# EasyEDA Pro project ProPrj_ESP32SoundBoard_2026-02-01.epro, schematic Development Board Pinouts

## Sheets
1 Development Board Pinouts: Create Date: 2026-01-09; Page Name: Development Board Pinouts; Project Name: ESP32SoundBoard; Schematic Name: Development Board Pinouts; Update Date: 2026-01-09; Company: EasyEDA.com; Page Size: A4; Version: V1.0
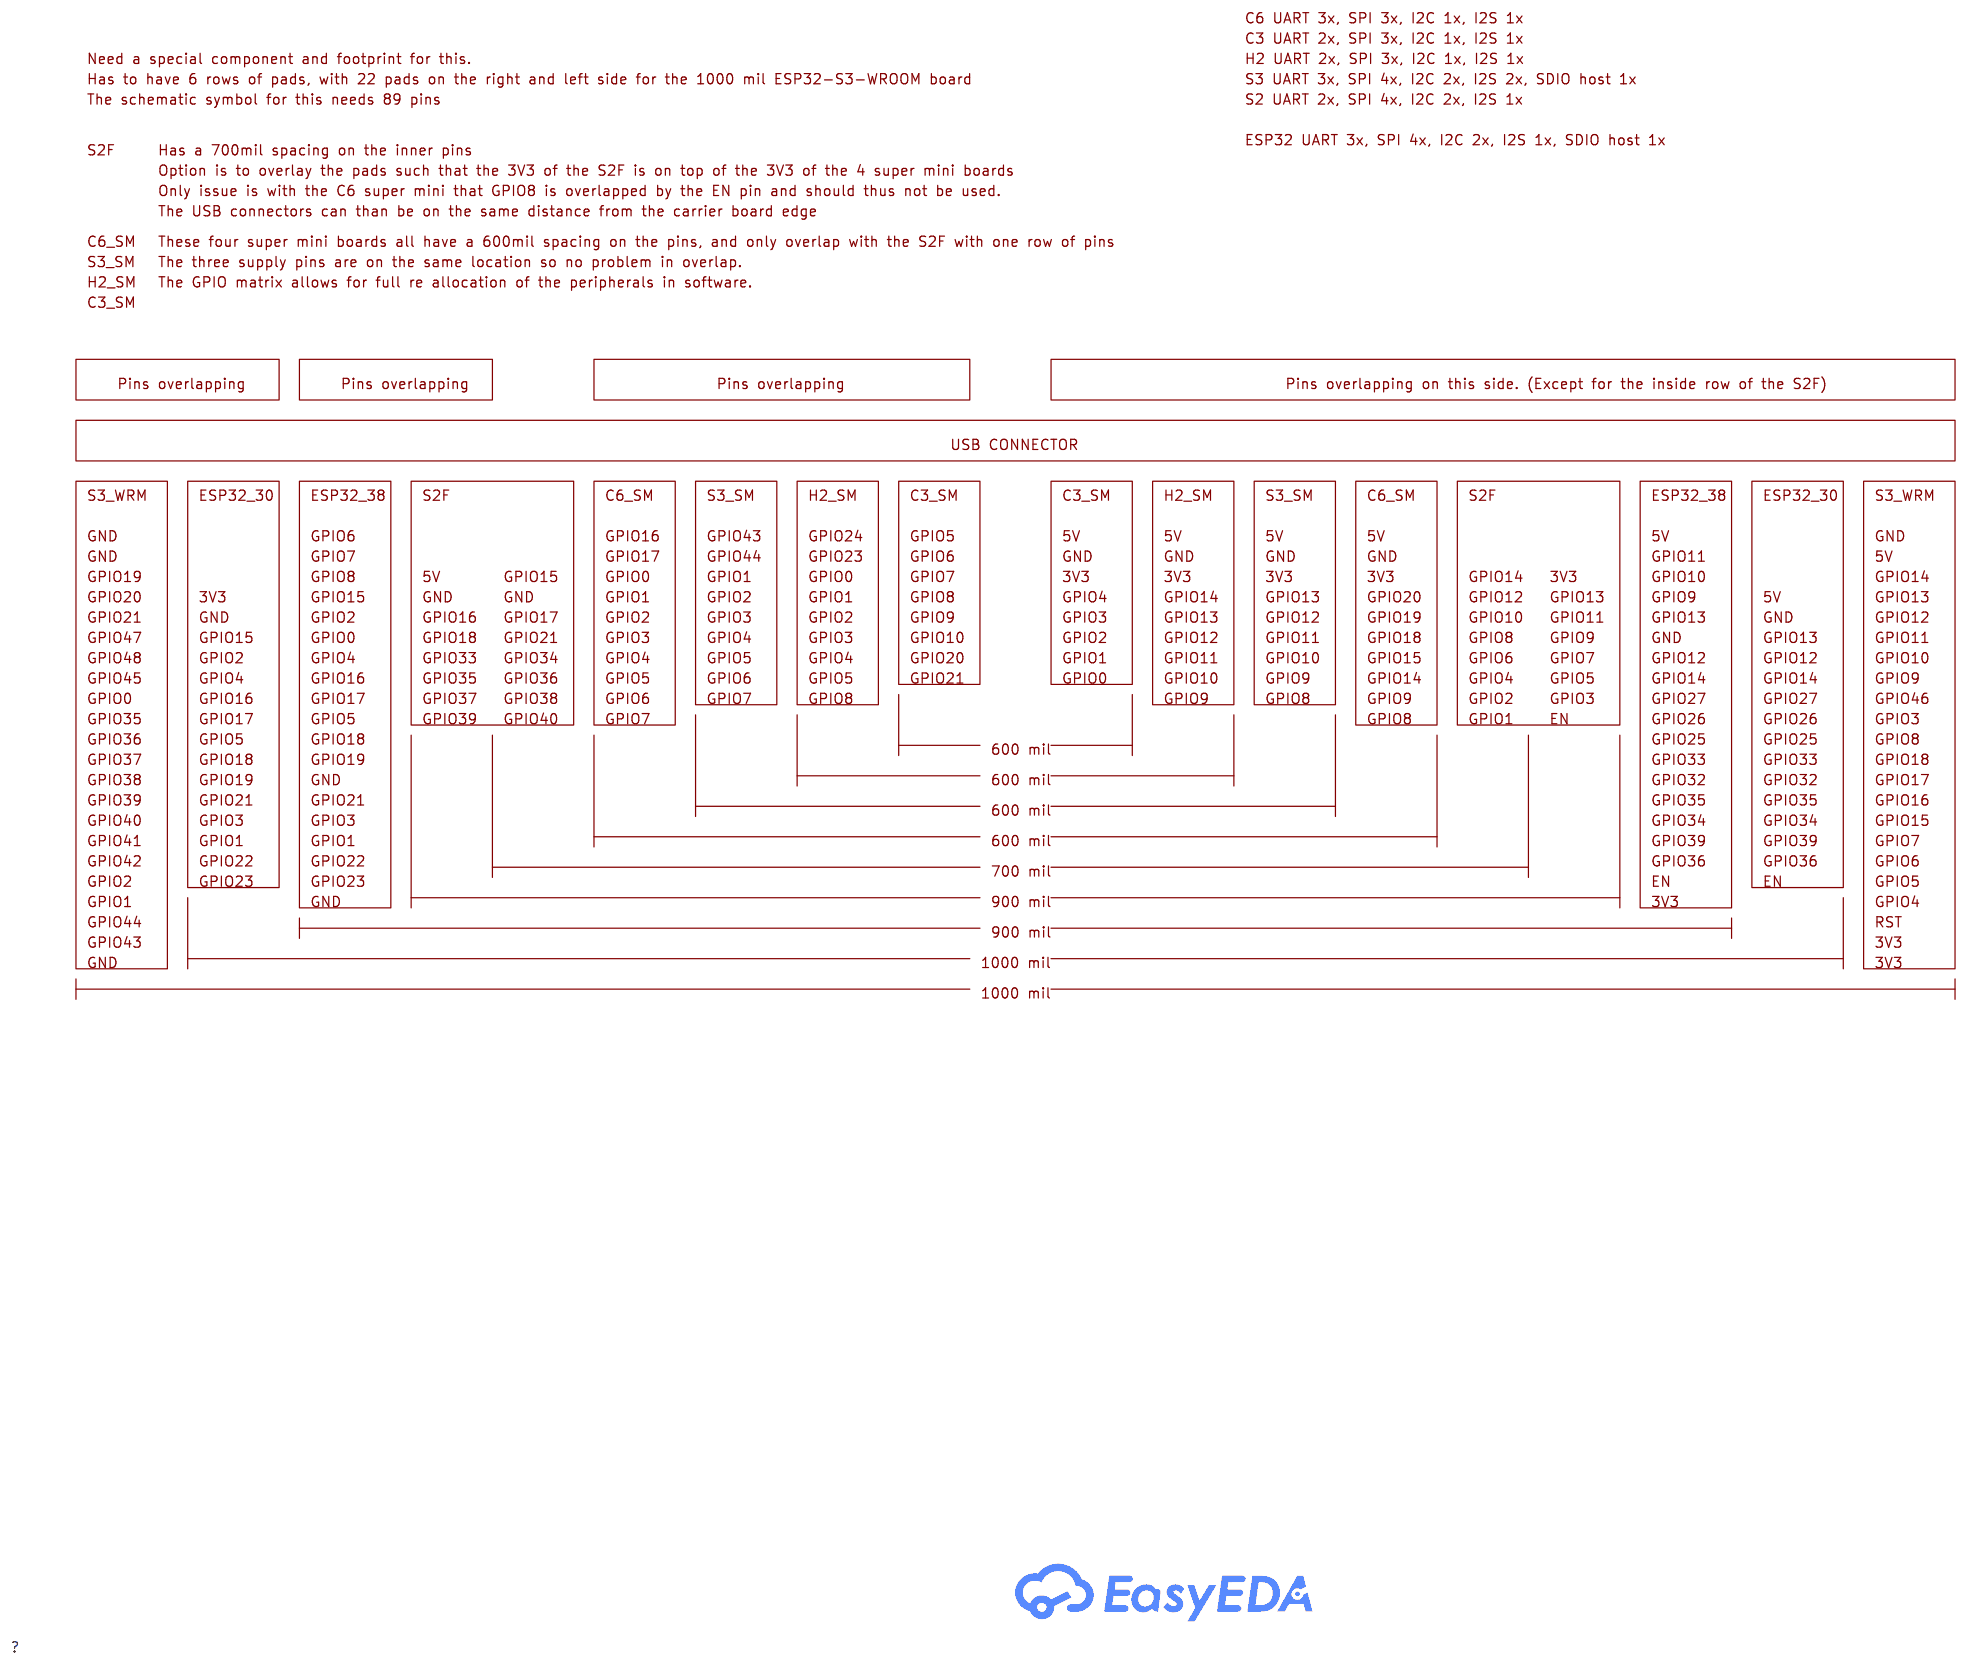
[diagram p2: Development Board Pinouts]
2 Jumper settings: Create Date: 2026-01-31; Page Name: Jumper settings; Update Date: 2026-02-01
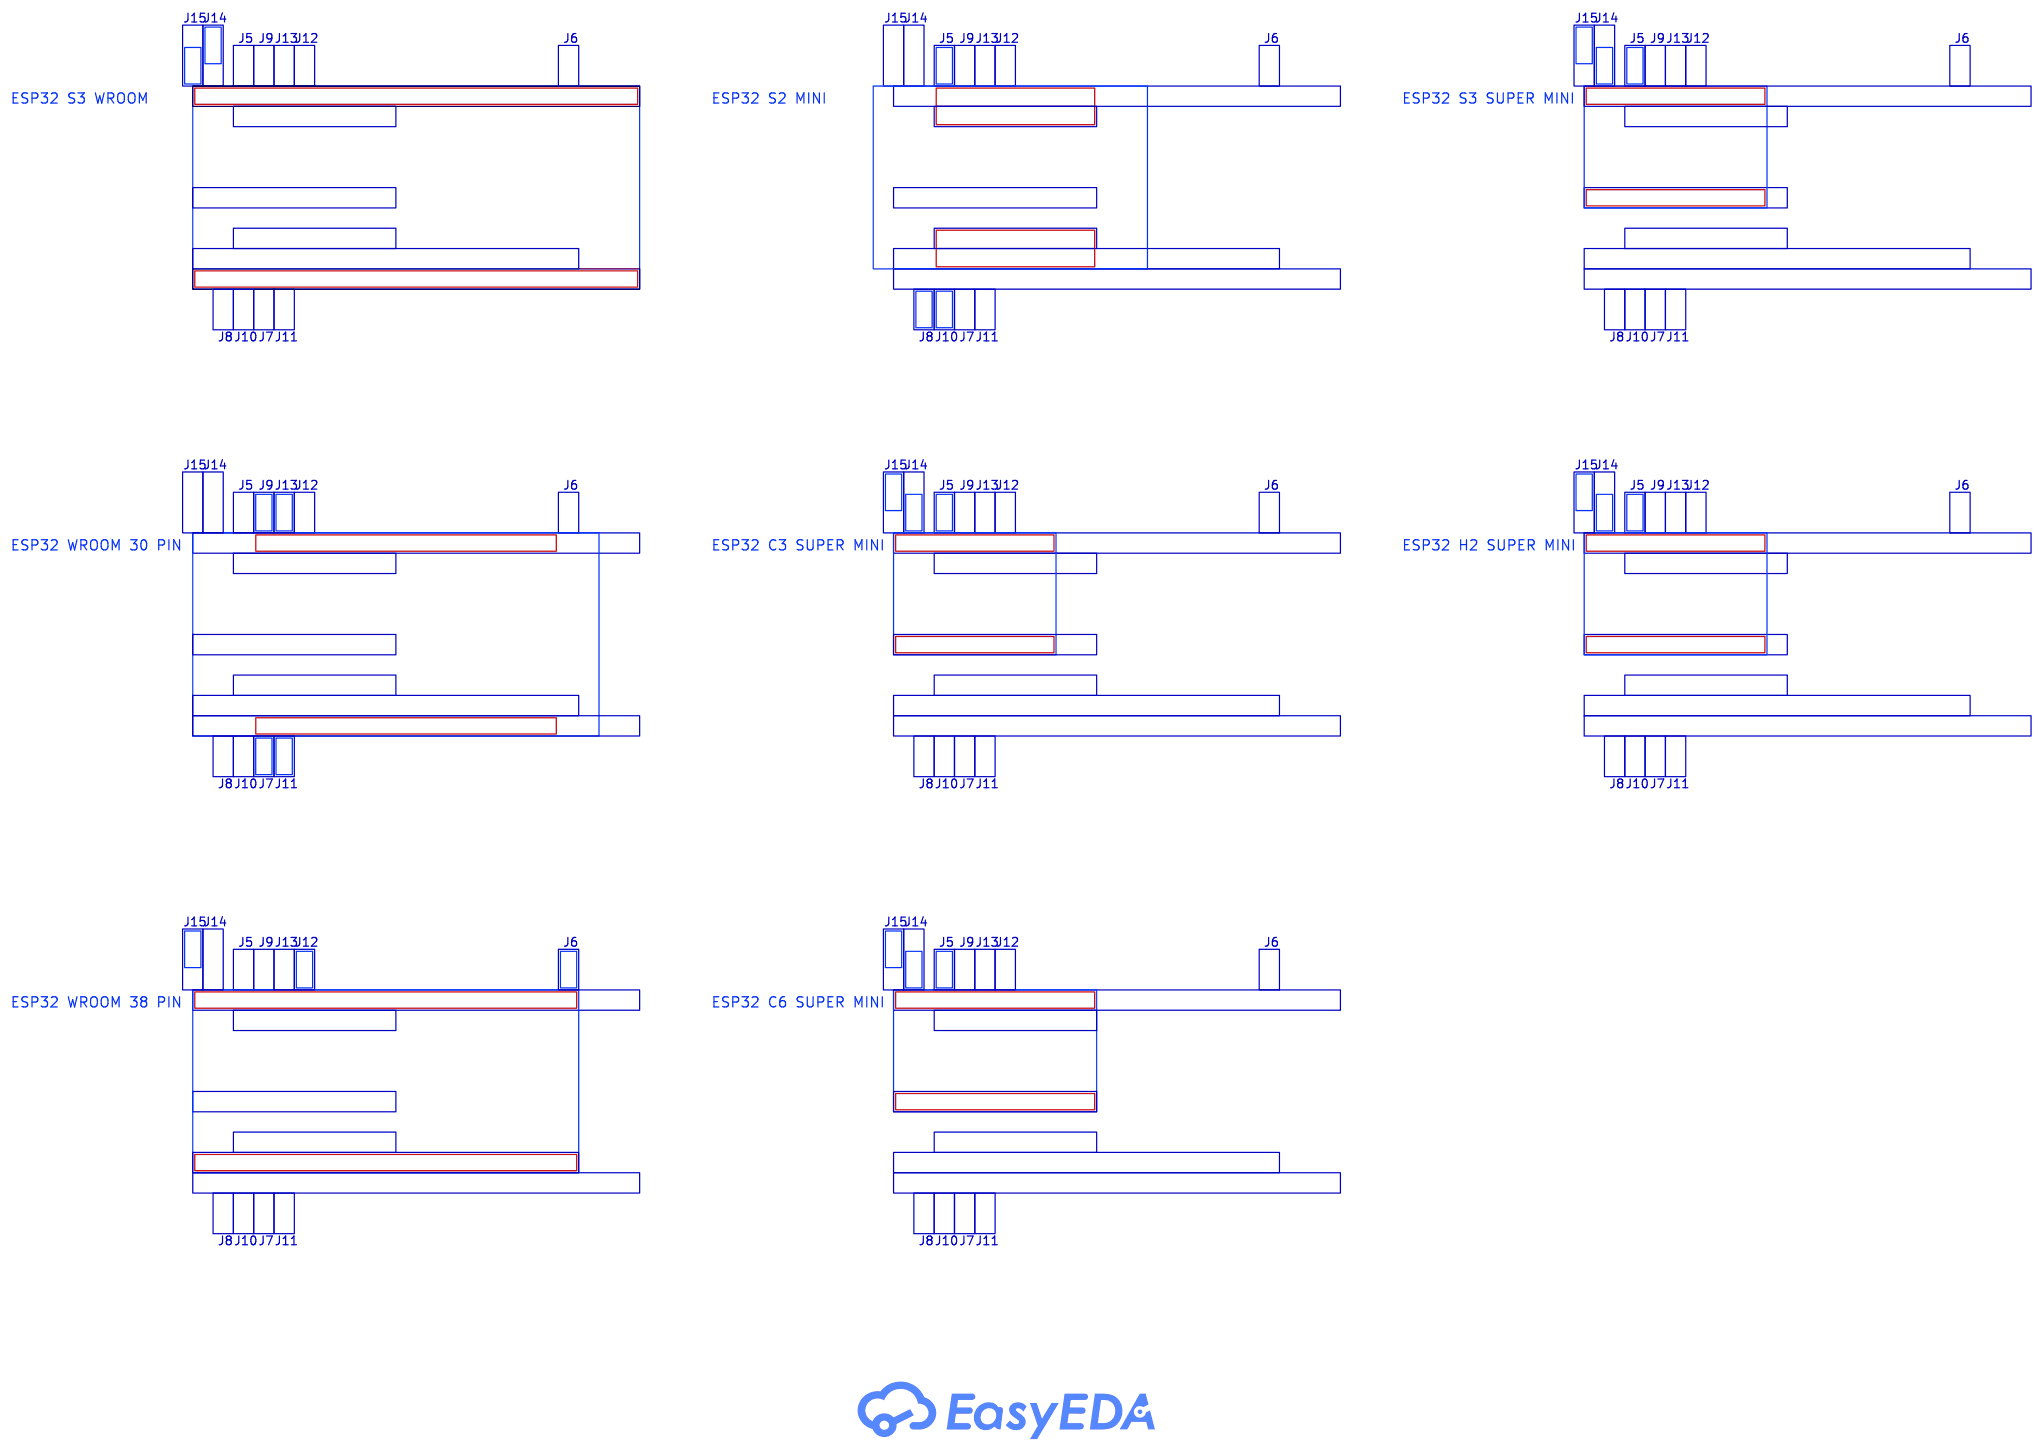
[diagram p3: Jumper settings]

## Parts
U1  -

## Library data of the parts
U1 = ESP32_DEV_BOARD_MIX_EXPLORE: A mix of ESP32 dev boards pinout to allow for an overlapping design

## Nets

## Notes on the sheets
sheet 2
- J15
- J14
- J15
- J14
- J15
- J14
- J5
- J9
- J13
- J12
- J6
- J5
- J9
- J13
- J12
- J6
- J5
- J9
- J13
- J12
- J6
- ESP32 S3 WROOM
- ESP32 S2 MINI
- ESP32 S3 SUPER MINI
- J8
- J10
- J7
- J11
- J8
- J10
- J7
- J11
- J8
- J10
- J7
- J11
- J15
- J14
- J15
- J14
- J15
- J14
- J5
- J9
- J13
- J12
- J6
- J5
- J9
- J13
- J12
- J6
- J5
- J9
- J13
- J12
- J6
- ESP32 WROOM 30 PIN
- ESP32 C3 SUPER MINI
- ESP32 H2 SUPER MINI
- J8
- J10
- J7
- J11
- J8
- J10
- J7
- J11
- J8
- J10
- J7
- J11
- J15
- J14
- J15
- J14
- J5
- J9
- J13
- J12
- J6
- J5
- J9
- J13
- J12
- J6
- ESP32 WROOM 38 PIN
- ESP32 C6 SUPER MINI
- J8
- J10
- J7
- J11
- J8
- J10
- J7
- J11
